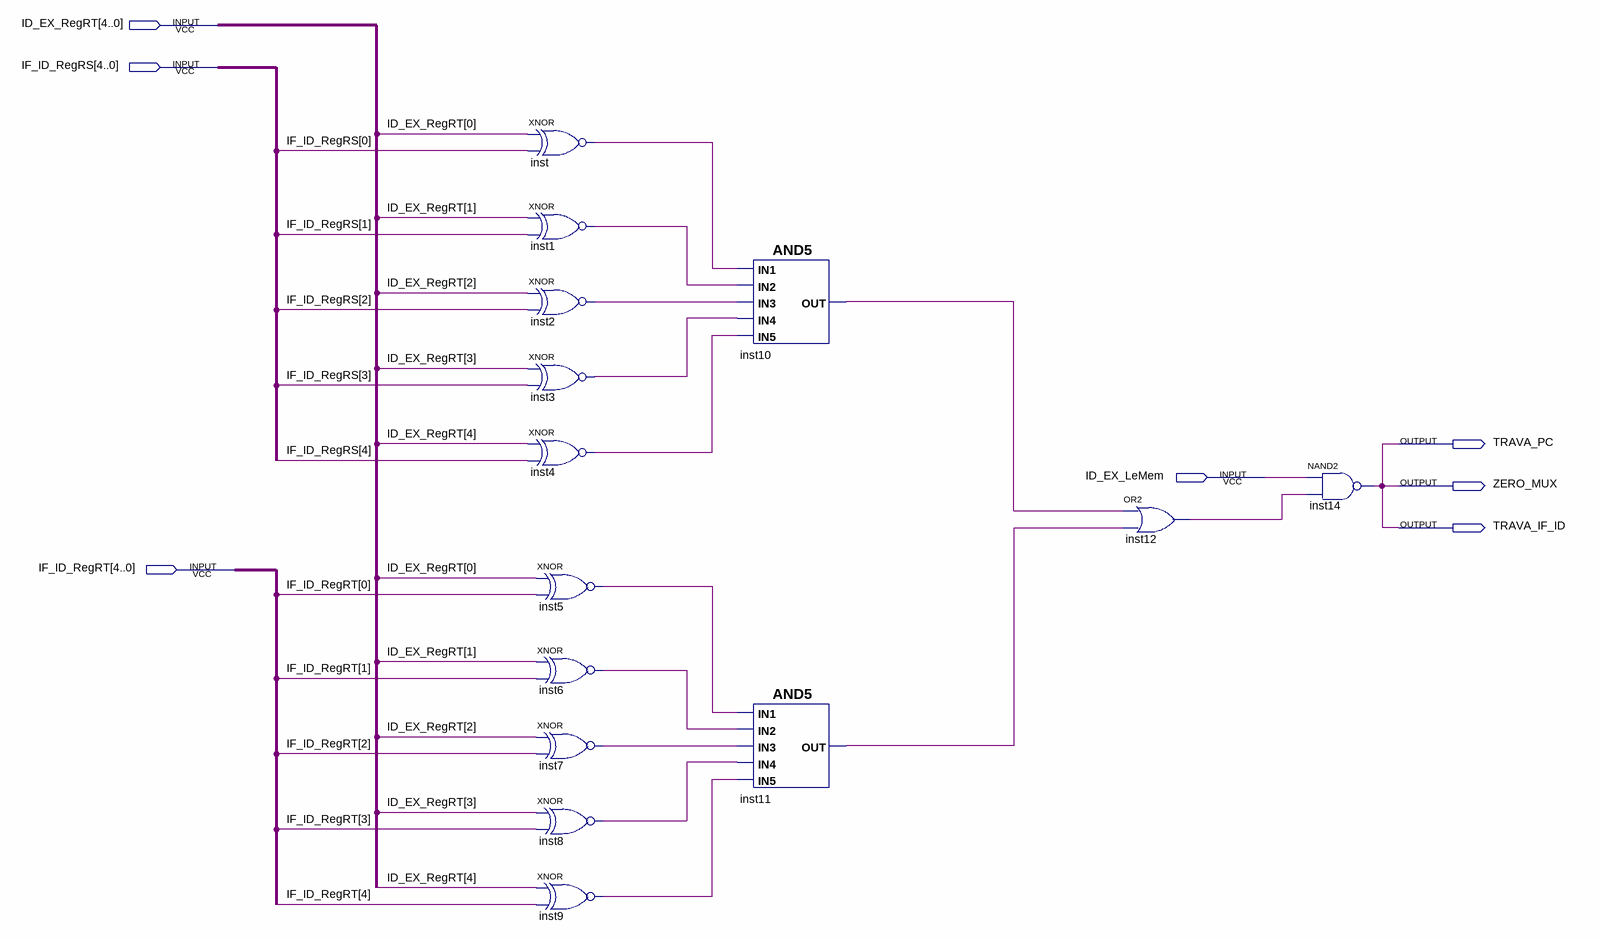
[diagram p0: schematic sheet]
// Quartus schematic UNI_HAZARD.bdf as structural Verilog: 14 symbols, 7 pins
module UNI_HAZARD (
  input  [4:0] ID_EX_RegRT,
  input  [4:0] IF_ID_RegRS,
  input  ID_EX_LeMem,
  input  [4:0] IF_ID_RegRT,
  output TRAVA_PC,
  output ZERO_MUX,
  output TRAVA_IF_ID
);

  wire inst1_out, inst2_out, inst3_out, inst4_out, inst5_out, inst6_out, inst7_out, inst8_out, inst9_out,
       inst10_out, inst11_out, inst12_out, inst_out;

  xnor inst (inst_out, ID_EX_RegRT[0], IF_ID_RegRS[0]);
  xnor inst1 (inst1_out, ID_EX_RegRT[1], IF_ID_RegRS[1]);
  xnor inst2 (inst2_out, ID_EX_RegRT[2], IF_ID_RegRS[2]);
  xnor inst3 (inst3_out, ID_EX_RegRT[3], IF_ID_RegRS[3]);
  xnor inst4 (inst4_out, ID_EX_RegRT[4], IF_ID_RegRS[4]);
  xnor inst5 (inst5_out, ID_EX_RegRT[0], IF_ID_RegRT[0]);
  xnor inst6 (inst6_out, ID_EX_RegRT[1], IF_ID_RegRT[1]);
  xnor inst7 (inst7_out, ID_EX_RegRT[2], IF_ID_RegRT[2]);
  xnor inst8 (inst8_out, ID_EX_RegRT[3], IF_ID_RegRT[3]);
  xnor inst9 (inst9_out, ID_EX_RegRT[4], IF_ID_RegRT[4]);
  and inst10 (inst10_out, inst_out, inst1_out, inst2_out, inst3_out, inst4_out);
  and inst11 (inst11_out, inst5_out, inst6_out, inst7_out, inst8_out, inst9_out);
  or inst12 (inst12_out, inst10_out, inst11_out);
  nand inst14 (TRAVA_IF_ID, ID_EX_LeMem, inst12_out);

  assign TRAVA_PC = TRAVA_IF_ID;
  assign ZERO_MUX = TRAVA_IF_ID;
endmodule
